# Altium project Tesis.PrjPcb
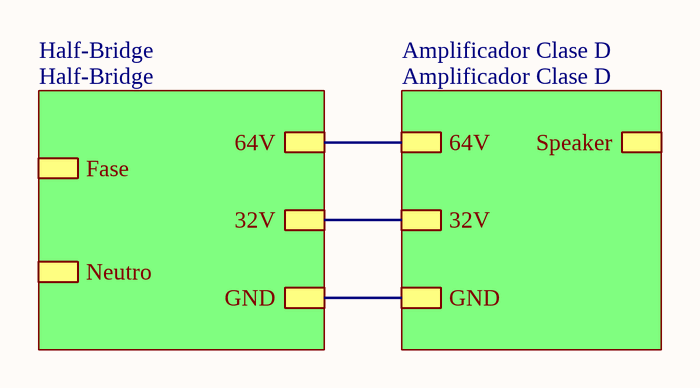
[diagram p0: Diagrama en bloques.SchDoc]
8 sheets, 136 parts. Net scope: hierarchical (ports join the sheet entries above them; power ports are global).
Board file: Filtros.PcbDoc
Sheets:
  Diagrama en bloques.SchDoc
    Half-Bridge = Half-Bridge.SchDoc
      Fly-Back = Fly-Back.SchDoc
  Step Down.SchDoc
  Pasa Altos.SchDoc
  Ganancia.SchDoc
  Generador De Retardo.SchDoc
  Mosfet Driver.SchDoc

## Sheet Diagrama en bloques.SchDoc
size A4; DocumentNumber: 1; SheetNumber: 1; SheetTotal: 5

### Sub-sheets
Amplificador Clase D = Amplificador Clase D (file not in this document): Speaker, 64V, 32V, GND
Half-Bridge = Half-Bridge: Fase, Neutro, 64V, 32V, GND

### Nets
NetC11_1: sheet Half-Bridge/64V, sheet Amplificador Clase D/64V
NetC11_2: sheet Half-Bridge/32V, sheet Amplificador Clase D/32V
NetC15_2: sheet Half-Bridge/GND, sheet Amplificador Clase D/GND

## Sheet Half-Bridge.SchDoc
size A4; DocumentNumber: 2; SheetNumber: 2; SheetTotal: 5
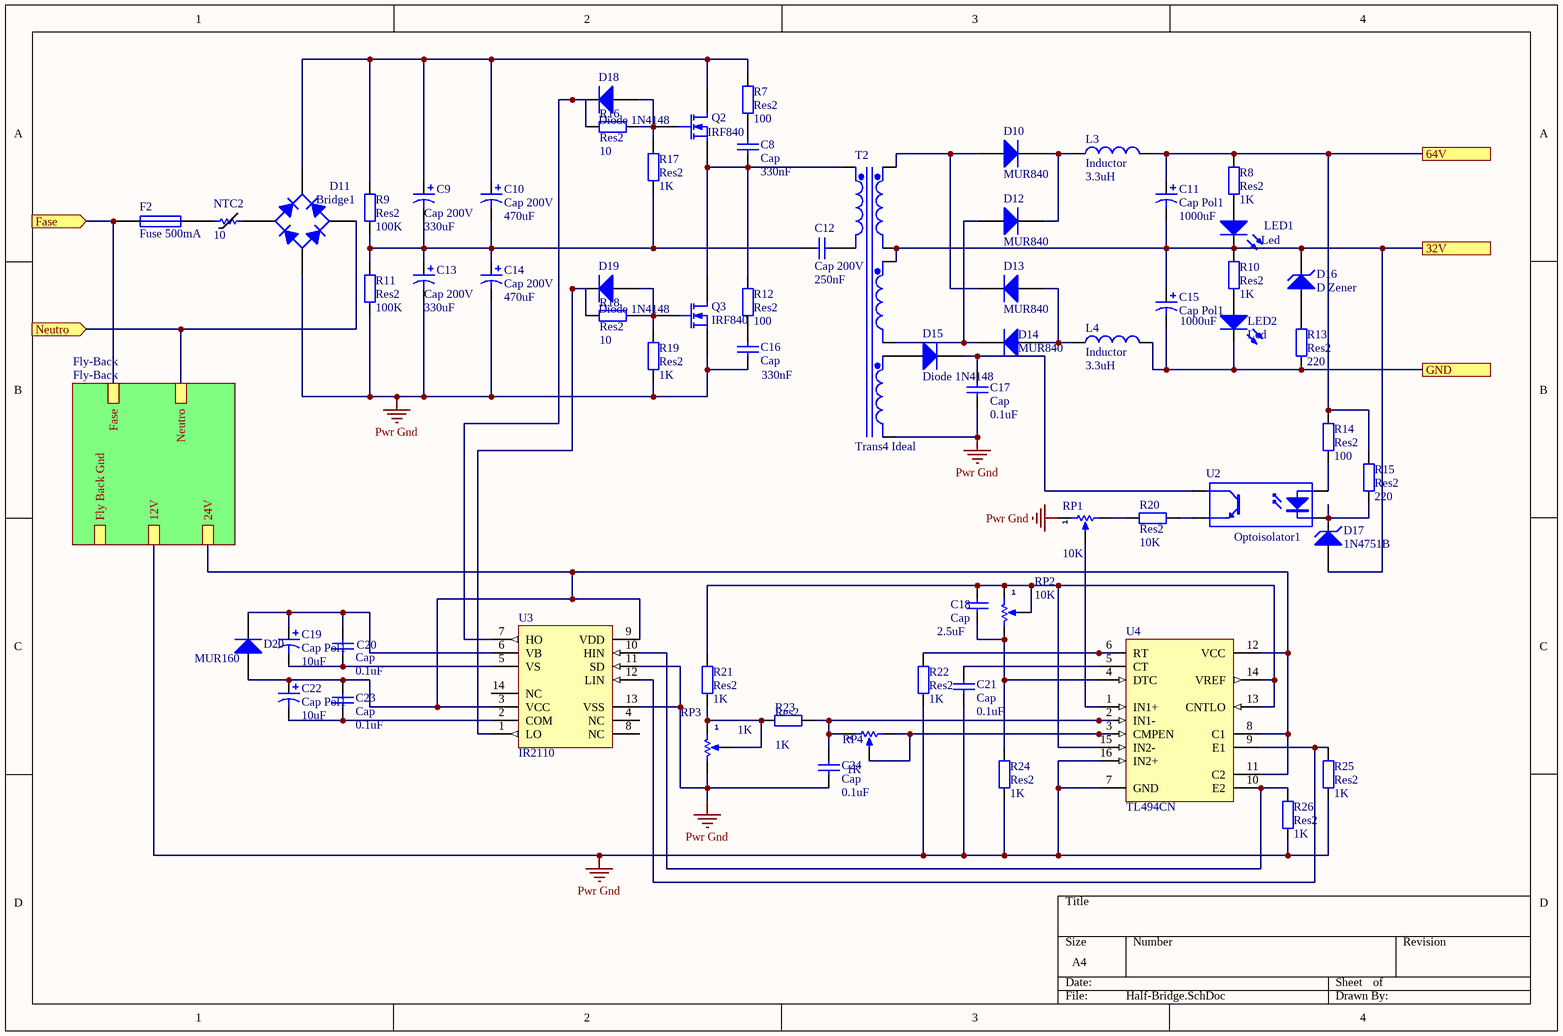
[diagram p1: Half-Bridge.SchDoc]

### Parts
C8  Cap  value 330nF  [RAD-0.3]
C9  Cap 200V  value 330uF  [RB7.6-15]
C10  Cap 200V  value 470uF  [RB7.6-15]
C11  Cap Pol1  value 1000uF  [RB7.6-15]
C12  Cap 200V  value 250nF  [RAD-0.3]
C13  Cap 200V  value 330uF  [RB7.6-15]
C14  Cap 200V  value 470uF  [RB7.6-15]
C15  Cap Pol1  value 1000uF  [RB7.6-15]
C16  Cap  value 330nF  [RAD-0.3]
C17  Cap  value 0.1uF  [RAD-0.3]
C18  Cap  value 2.5uF  [RAD-0.3]
C19  Cap Pol1  value 10uF  [RB7.6-15]
C20  Cap  value 0.1uF  [RAD-0.3]
C21  Cap  value 0.1uF  [RAD-0.3]
C22  Cap Pol1  value 10uF  [RB7.6-15]
C23  Cap  value 0.1uF  [RAD-0.3]
C24  Cap  value 0.1uF  [RAD-0.3]
D10  MUR840  [DO-35]
D11  Bridge1  [D-38]
D12  MUR840  [DO-35]
D13  MUR840  [DO-35]
D14  MUR840  [DO-35]
D15  Diode 1N4148  [DO-35]
D16  D Zener  [DIODE-0.7]
D17  1N4751B  [DIODE-0.7]
D18  Diode 1N4148  [DO-35]
D19  Diode 1N4148  [DO-35]
D20  MUR160  [DO-35]
F2  Fuse 500mA  [PIN-W2/E2.8]
L3  Inductor  value 3.3uH  [0402-A]
L4  Inductor  value 3.3uH  [0402-A]
LED1  VALOR: Led  [Led 3mm AMARILLO]  (hidden comment: Diodo Led)
LED2  VALOR: Led  [Led 3mm AMARILLO]  (hidden comment: Diodo Led)
NTC2  VALOR: 10  [R0805]  (hidden comment: Termistor NTC)
Q2  IRF840  [E3]
Q3  IRF840  [E3]
R7  Res2  value 100  [AXIAL-0.4]
R8  Res2  value 1K  [AXIAL-0.4]
R9  Res2  value 100K  [AXIAL-0.4]
R10  Res2  value 1K  [AXIAL-0.4]
R11  Res2  value 100K  [AXIAL-0.4]
R12  Res2  value 100  [AXIAL-0.4]
R13  Res2  value 220  [AXIAL-0.4]
R14  Res2  value 100  [AXIAL-0.4]
R15  Res2  value 220  [AXIAL-0.4]
R16  Res2  value 10  [AXIAL-0.4]
R17  Res2  value 1K  [AXIAL-0.4]
R18  Res2  value 10  [AXIAL-0.4]
R19  Res2  value 1K  [AXIAL-0.4]
R20  Res2  value 10K  [AXIAL-0.4]
R21  Res2  value 1K  [AXIAL-0.4]
R22  Res2  value 1K  [AXIAL-0.4]
R23  Res2  value 1K  [AXIAL-0.4]
R24  Res2  value 1K  [AXIAL-0.4]
R25  Res2  value 1K  [AXIAL-0.4]
R26  Res2  value 1K  [AXIAL-0.4]
RP1  VALOR: 10K  [Trimpot Multivuelta Horizontal]  (hidden comment: Trimpot)
RP2  VALOR: 10K  [Trimpot Multivuelta Horizontal]  (hidden comment: Trimpot)
RP3  VALOR: 1K  [Trimpot Multivuelta Horizontal]  (hidden comment: Trimpot)
RP4  VALOR: 1K  [Trimpot Multivuelta Horizontal]  (hidden comment: Trimpot)
T2  Trans4 Ideal  [TRF_8]
U2  Optoisolator1  [DIP-4]
U3  IR2110  [PDIP14]
U4  TL494CN  [DIP-16]

### Sub-sheets
Fly-Back = Fly-Back: 24V, 12V, Fly Back Gnd, Fase, Neutro

### Ports
32V, 64V, Fase (in), GND, Neutro (in)

### Nets
Pwr Gnd: C13.2 C14.2 C16.1 C17.1 C21.1 C24.1 D11.3(A) Q3.3(S) R11.1 R19.2 R22.1 R24.1 R25.1 R26.1 RP1.1(TOP) RP3.2(BOT) T2.8(Sec3-) U3.11(SD) U3.13(VSS) U4.7(GND) U4.16(IN2+) ; sheet Fly-Back/12V
NetC1_1: C22.1 C23.2 D20.1(A) U3.3(VCC) U3.9(VDD) U4.8(C1) U4.11(C2) U4.12(VCC) ; sheet Fly-Back/24V
NetC8_1: C8.1 Q2.3(S) Q3.1(D) R12.2 T2.1(Pri+)
NetC8_2: C8.2 R7.1
NetC9_1: C9.1 C10.1 D11.1(K) Q2.1(D) R7.2 R9.2
NetC9_2: C9.2 C10.2 C12.1 C13.1 C14.1 R9.1 R11.2 R17.1
NetC11_1: C11.1 L3.2 R8.2 R14.2 R15.2 ; port 64V
NetC11_2: C11.2 C15.1 D16.2(K) D17.1(A) LED1.2(K) R10.2 T2.4(Sec1-) T2.5(Sec2+) ; port 32V
NetC12_2: C12.2 T2.2(Pri-)
NetC15_2: C15.2 L4.2 LED2.2(K) R13.1 ; port GND
NetC16_2: C16.2 R12.1
NetC17_2: C17.2 D15.2(K) U2.4(C)
NetC18_1: C18.1 R24.2 RP2.2(BOT) U4.4(DTC)
NetC18_2: C18.2 R21.2 RP2.1(TOP) RP2.3(TAP) U4.13(CNTLO) U4.14(VREF) U4.15(IN2-)
NetC19_1: C19.1 C20.2 D20.2(K) U3.6(VB)
NetC19_2: C19.2 C20.1 U3.5(VS)
NetC21_2: C21.2 U4.5(CT)
NetC22_2: C22.2 C23.1 U3.2(COM)
NetC24_2: C24.2 R23.2 RP4.1(TOP) U4.2(IN1-)
NetD4_2: D11.2(C) ; port Neutro, sheet Fly-Back/Neutro
NetD10_1: D10.1(A) D13.2(K) T2.3(Sec1+)
NetD10_2: D10.2(K) D12.2(K) L3.1
NetD11_4: D11.4(C) NTC2.1
NetD12_1: D12.1(A) D14.2(K) T2.6(Sec2-)
NetD13_1: D13.1(A) D14.1(A) L4.1
NetD15_1: D15.1(A) T2.7(Sec3+)
NetD16_1: D16.1(A) R13.2
NetD17_2: D17.2(K) R15.1 U2.2(K)
NetD18_1: D18.1(A) Q2.2(G) R16.2 R17.2
NetD18_2: D18.2(K) R16.1 U3.7(HO)
NetD19_1: D19.1(A) Q3.2(G) R18.1 R19.1
NetD19_2: D19.2(K) R18.2 U3.1(LO)
NetF1_1: F2.1 ; port Fase, sheet Fly-Back/Fase
NetF2_2: F2.2 NTC2.2
NetLED1_1: LED1.1(A) R8.1
NetLED2_1: LED2.1(A) R10.1
NetR14_1: R14.1 U2.1(A)
NetR20_1: R20.1 U2.3(E)
NetR20_2: R20.2 RP1.2(BOT)
NetR21_1: R21.1 R23.1 RP3.1(TOP) RP3.3(TAP)
NetR22_2: R22.2 U4.6(RT)
NetR25_2: R25.2 U3.12(LIN) U4.9(E1)
NetR26_2: R26.2 U3.10(HIN) U4.10(E2)
NetRP1_3: RP1.3(TAP) U4.1(IN1+)
NetRP4_2: RP4.2(BOT) RP4.3(TAP) U4.3(CMPEN)

Not connected (* = marked no-connect by the designer): U3 4(NC) 8(NC) 14(NC)

### Library data of the parts
C8 C12 C16-C18 C20 C21 C23 C24 = Cap: Capacitor; Published: 8-Jun-2000; LatestRevisionDate: 17-Jul-2002; LatestRevisionNote: Re-released for DXP Platform.; PackageReference: RAD-0.3; Publisher: Altium Limited; PackageDescription: Radial Cap, Thru-Hole; 2 Leads; 0.3 in Pin Spacing
C9-C11 C13-C15 C19 C22 = Cap Pol1: Polarized Capacitor (Radial); Published: 8-Jun-2000; LatestRevisionDate: 17-Jul-2002; LatestRevisionNote: Re-released for DXP Platform.; PackageReference: RB7.6-15; Publisher: Altium Limited; PackageDescription: Polarized Capacitor (Radial); 2 Leads
D10 D12-D15 D18-D20 = Diode 1N4148: High Conductance Fast Diode; Published: 8-Jun-2000; LatestRevisionDate: 17-Jul-2002; LatestRevisionNote: Re-released for DXP Platform.; DatasheetVersion: 1997; PackageReference: DO-35; Publisher: Altium Limited; PackageDescription: Diode, Axial; Body 3.8 x 1.9 mm (LxDia. max), Lead Dia. 0.53 mm (max); Code_JEDEC: DO-204-AH; ComponentLink1Description: Manufacturer Link; ComponentLink1URL: http://www.fairchildsemi.com/; ComponentLink2Description: Datasheet; ComponentLink2URL: http://www.fairchildsemi.com/ds/1N%2F1N4148.pdf
D11 = Bridge1: Full Wave Diode Bridge; Published: 8-Jun-2000; LatestRevisionDate: 29-May-2009; LatestRevisionNote: Sch pins A & K swapped.; DatasheetVersion: E2732B; PackageReference: D-38; Publisher: Altium Limited; PackageDescription: Bridge Rectifier; 4 Terminals; Body 9.4 x 9.4 mm (typ); Pitch 5.08 mm
D16 D17 = D Zener: Zener Diode; Published: 8-Jun-2000; LatestRevisionDate: 17-Jul-2002; LatestRevisionNote: Re-released for DXP Platform.; PackageReference: DIODE-0.7; Publisher: Altium Limited; PackageDescription: Diode, Thru-Hole; 2 Leads; 0.7 in Pin Spacing
F2 = Fuse 1: Fuse; Published: 8-Jun-2000; LatestRevisionDate: 17-Jul-2002; LatestRevisionNote: Re-released for DXP Platform.; PackageReference: PIN-W2/E2.8; Publisher: Altium Limited; PackageDescription: Thru-Hole; 2 Leads
L3 L4 = Inductor: Code_IEC: 1005; Published: 8-Jun-2000; LatestRevisionDate: 29-May-2009; LatestRevisionNote: IPC-7351 Footprint Added.; PackageReference: 0402-A; Publisher: Altium Limited; PackageDescription: Chip Inductor; Code_JEITA: 0402
LED1 LED2 = Diodo Led: Led 3mm; CODIGO STI: *; PROVEEDOR: *; FABRICANTE: *
NTC2 = Termistor NTC: Termistor NTC SMD; PROVEEDOR: *; CODIGO STI: *; FABRICANTE: *
Q2 Q3 = MOSFET-N: N-Channel MOSFET; Published: 8-Jun-2000; LatestRevisionDate: 17-Jul-2002; LatestRevisionNote: Re-released for DXP Platform.; PackageVersion: 1995/1996; PackageReference: E3; Publisher: Altium Limited; PackageDescription: TO, Flat Index; 3 In-Line, Axial Leads; Body Dia. 4.6mm; Lead Dia. 0.5 mm (max)
R7-R26 = Res2: Resistor; Published: 8-Jun-2000; LatestRevisionDate: 17-Jul-2002; LatestRevisionNote: Re-released for DXP Platform.; PackageReference: AXIAL-0.4; Publisher: Altium Limited; PackageDescription: Axial Device, Thru-Hole; 2 Leads; 0.4 in Pin Spacing
RP1-RP4 = Trimpot: Preset; CODIGO STI: *; PROVEEDOR: *; FABRICANTE: *
  RP1: PART NUMBER: *
T2 = Trans4 Ideal: Four-winding Transformer (Ideal); Published: 25-Jan-2001; LatestRevisionDate: 17-Jul-2002; LatestRevisionNote: Re-released for DXP Platform.; PackageReference: TRF_8; Publisher: Altium Limited; PackageDescription: Transformer; 8 Leads
U2 = Optoisolator1: 4-Pin Phototransistor Optocoupler; Published: 24-Mar-1999; LatestRevisionDate: 04-Mar-2005; LatestRevisionNote: Sch pins 3 & 4 Swapped.; DatasheetVersion: Nov-2003; PackageReference: DIP-4; Publisher: Altium Limited
U3 = IR2110: High and Low Side Driver; Note: Pins 4, 8 and 14 are not connected; Published: 8-Jun-2000; LatestRevisionDate: 04-Mar-2005; LatestRevisionNote: Stylized 3D Model Added.; DatasheetVersion: PD60147J; PackageReference: PDIP14; Publisher: Altium Limited; PackageDescription: DIP; 14 Leads; Row Spacing 7.62 mm; Pitch 2.54 mm; ComponentLink1Description: Manufacturer Link; ComponentLink1URL: http://www.irf.com/; ComponentLink2Description: Datasheet; ComponentLink2URL: http://www.irf.com/product-info/datasheets/data/ir2110.pdf
U4 = TL494CN: Switchmode Pulse Width Modulation Control Circuit; Published: 15-Apr-2002; DatasheetVersion: 1996; PackageVersion: Apr-2000; PackageReference: 648-08; Publisher: Altium Limited; PackageDescription: DIP; 16 Leads; Row Spacing 7.62 mm; Pitch 2.54 mm; Code_JEDEC: MS-001-BB; ComponentLink1Description: Manufacturer Link; ComponentLink1URL: http://www.onsemi.com/site/products/taxonomy/0,4438,503,00.html; ComponentLink2Description: Datasheet; ComponentLink2URL: http://www.onsemi.com/pub/Collateral/TL494-D.PDF

## Sheet Fly-Back.SchDoc
size A4; DocumentNumber: 3; SheetNumber: 3; SheetTotal: 5
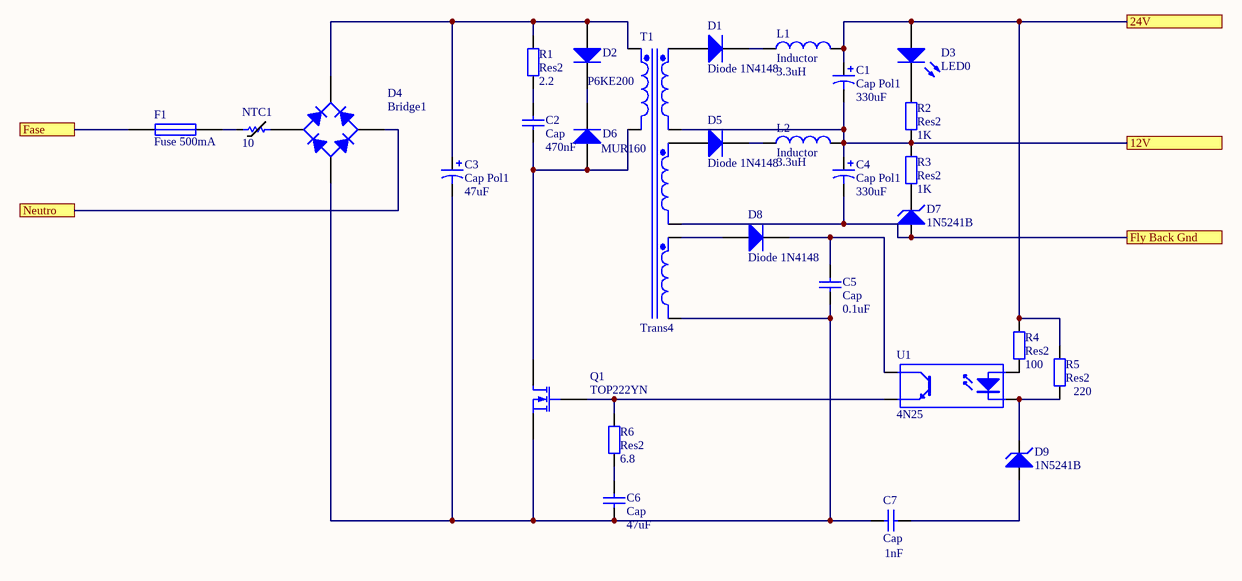
[diagram p2: Fly-Back.SchDoc]

### Parts
C1  Cap Pol1  value 330uF  [RB7.6-15]
C2  Cap  value 470nF  [RAD-0.3]
C3  Cap Pol1  value 47uF  [RB7.6-15]
C4  Cap Pol1  value 330uF  [RB7.6-15]
C5  Cap  value 0.1uF  [RAD-0.3]
C6  Cap  value 47uF  [RAD-0.3]
C7  Cap  value 1nF  [RAD-0.3]
D1  Diode 1N4148  [DO-35]
D2  P6KE200  [DO-35]
D3  LED0  [LED-0]
D4  Bridge1  [D-38]
D5  Diode 1N4148  [DO-35]
D6  MUR160  [DO-35]
D7  VALOR: 1N5241B  [DO-41]  (hidden comment: Diodo Zener)
D8  Diode 1N4148  [DO-35]
D9  VALOR: 1N5241B  [DO-41]  (hidden comment: Diodo Zener)
F1  Fuse 500mA  [PIN-W2/E2.8]
L1  Inductor  value 3.3uH  [0402-A]
L2  Inductor  value 3.3uH  [0402-A]
NTC1  VALOR: 10  [R0805]  (hidden comment: Termistor NTC)
Q1  TOP222YN  [E3]
R1  Res2  value 2.2  [AXIAL-0.4]
R2  Res2  value 1K  [AXIAL-0.4]
R3  Res2  value 1K  [AXIAL-0.4]
R4  Res2  value 100  [AXIAL-0.4]
R5  Res2  value 220  [AXIAL-0.4]
R6  Res2  value 6.8  [AXIAL-0.4]
T1  Trans4  [TRF_8]
U1  4N25  [DIP-4]

### Ports
12V, 24V, Fase, Fly Back Gnd, Neutro

### Nets
Pwr Gnd: C1.2 C4.1 L2.2 R2.1 R3.2 T1.4(Sec1-) ; port 12V
NetC1_1: C1.1 D3.1(A) L1.2 R4.2 R5.2 ; port 24V
NetC2_1: C2.1 D6.1(A) Q1.1(D) T1.2(Pri-)
NetC2_2: C2.2 R1.1
NetC3_1: C3.1 D2.1(A) D4.1(K) R1.2 T1.1(Pri+)
NetC3_2: C3.2 C5.1 C6.1 C7.1 D4.3(A) Q1.3(S) T1.8(Sec3-)
NetC4_2: C4.2 D7.1(A) T1.6(Sec2-) ; port Fly Back Gnd
NetC5_2: C5.2 D8.2(K) U1.4(C)
NetC6_2: C6.2 R6.1
NetC7_2: C7.2 D9.1(A)
NetD1_1: D1.1(A) T1.3(Sec1+)
NetD1_2: D1.2(K) L1.1
NetD2_2: D2.2(K) D6.2(K)
NetD3_2: D3.2(K) R2.2
NetD4_2: D4.2(C) ; port Neutro
NetD4_4: D4.4(C) NTC1.1
NetD5_1: D5.1(A) T1.5(Sec2+)
NetD5_2: D5.2(K) L2.1
NetD7_2: D7.2(K) R3.1
NetD8_1: D8.1(A) T1.7(Sec3+)
NetD9_2: D9.2(K) R5.1 U1.2(K)
NetF1_1: F1.1 ; port Fase
NetF1_2: F1.2 NTC1.2
NetQ1_2: Q1.2(G) R6.2 U1.3(E)
NetR4_1: R4.1 U1.1(A)

### Library data of the parts
C1 C3 C4 = Cap Pol1: Polarized Capacitor (Radial); Published: 8-Jun-2000; LatestRevisionDate: 17-Jul-2002; LatestRevisionNote: Re-released for DXP Platform.; PackageReference: RB7.6-15; Publisher: Altium Limited; PackageDescription: Polarized Capacitor (Radial); 2 Leads
C2 C5-C7 = Cap: Capacitor; Published: 8-Jun-2000; LatestRevisionDate: 17-Jul-2002; LatestRevisionNote: Re-released for DXP Platform.; PackageReference: RAD-0.3; Publisher: Altium Limited; PackageDescription: Radial Cap, Thru-Hole; 2 Leads; 0.3 in Pin Spacing
D1 D2 D5 D6 D8 = Diode 1N4148: High Conductance Fast Diode; Published: 8-Jun-2000; LatestRevisionDate: 17-Jul-2002; LatestRevisionNote: Re-released for DXP Platform.; DatasheetVersion: 1997; PackageReference: DO-35; Publisher: Altium Limited; PackageDescription: Diode, Axial; Body 3.8 x 1.9 mm (LxDia. max), Lead Dia. 0.53 mm (max); Code_JEDEC: DO-204-AH; ComponentLink1Description: Manufacturer Link; ComponentLink1URL: http://www.fairchildsemi.com/; ComponentLink2Description: Datasheet; ComponentLink2URL: http://www.fairchildsemi.com/ds/1N%2F1N4148.pdf
D3 = LED0: Typical INFRARED GaAs LED; Published: 8-Jun-2000; LatestRevisionDate: 08-Jul-2005; LatestRevisionNote: Mech Layer 1 removed.; PackageReference: LED-0; Publisher: Altium Limited; PackageDescription: LED; 2 Leads
D4 = Bridge1: Full Wave Diode Bridge; Published: 8-Jun-2000; LatestRevisionDate: 29-May-2009; LatestRevisionNote: Sch pins A & K swapped.; DatasheetVersion: E2732B; PackageReference: D-38; Publisher: Altium Limited; PackageDescription: Bridge Rectifier; 4 Terminals; Body 9.4 x 9.4 mm (typ); Pitch 5.08 mm
F1 = Fuse 1: Fuse; Published: 8-Jun-2000; LatestRevisionDate: 17-Jul-2002; LatestRevisionNote: Re-released for DXP Platform.; PackageReference: PIN-W2/E2.8; Publisher: Altium Limited; PackageDescription: Thru-Hole; 2 Leads
L1 L2 = Inductor: Code_IEC: 1005; Published: 8-Jun-2000; LatestRevisionDate: 29-May-2009; LatestRevisionNote: IPC-7351 Footprint Added.; PackageReference: 0402-A; Publisher: Altium Limited; PackageDescription: Chip Inductor; Code_JEITA: 0402
NTC1 = Termistor NTC: Termistor NTC SMD; PROVEEDOR: *; CODIGO STI: *; FABRICANTE: *
Q1 = MOSFET-N: N-Channel MOSFET; Published: 8-Jun-2000; LatestRevisionDate: 17-Jul-2002; LatestRevisionNote: Re-released for DXP Platform.; PackageVersion: 1995/1996; PackageReference: E3; Publisher: Altium Limited; PackageDescription: TO, Flat Index; 3 In-Line, Axial Leads; Body Dia. 4.6mm; Lead Dia. 0.5 mm (max)
R1-R6 = Res2: Resistor; Published: 8-Jun-2000; LatestRevisionDate: 17-Jul-2002; LatestRevisionNote: Re-released for DXP Platform.; PackageReference: AXIAL-0.4; Publisher: Altium Limited; PackageDescription: Axial Device, Thru-Hole; 2 Leads; 0.4 in Pin Spacing
T1 = Trans4: Four-winding Transformer (Non-Ideal); Sim Note: Enter the turns ratios, Core loss resistance, Magnetising Reactance, Leakage Reactances and Resistances referred to the primary side into the parameter fields.; Published: 25-Jan-2001; LatestRevisionDate: 17-Jul-2002; LatestRevisionNote: Re-released for DXP Platform.; PackageReference: TRF_8; Publisher: Altium Limited; PackageDescription: Transformer; 8 Leads
U1 = Optoisolator1: 4-Pin Phototransistor Optocoupler; Published: 24-Mar-1999; LatestRevisionDate: 04-Mar-2005; LatestRevisionNote: Sch pins 3 & 4 Swapped.; DatasheetVersion: Nov-2003; PackageReference: DIP-4; Publisher: Altium Limited
D7 D9 = Diodo Zener: CODIGO STI: *; PROVEEDOR: *; FABRICANTE: *

## Sheet Step Down.SchDoc
size A4
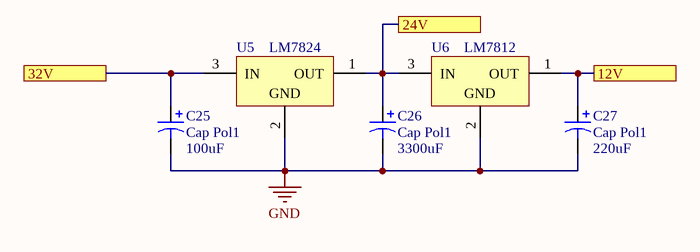
[diagram p3: Step Down.SchDoc]

### Parts
C25  Cap Pol1  value 100uF  [RB7.6-15]
C26  Cap Pol1  value 3300uF  [RB7.6-15]
C27  Cap Pol1  value 220uF  [RB7.6-15]
U5  LM7824  [Z03A]
U6  LM7812  [Z03A]

### Ports
12V, 24V, 32V

### Nets
GND: C25.2 C26.2 C27.2 U5.2(GND) U6.2(GND)
NetC25_1: C25.1 U5.3(IN) ; port 32V
NetC26_1: C26.1 U5.1(OUT) U6.3(IN) ; port 24V
NetC27_1: C27.1 U6.1(OUT) ; port 12V

### Library data of the parts
C25-C27 = Cap Pol1: Polarized Capacitor (Radial); Published: 8-Jun-2000; LatestRevisionDate: 17-Jul-2002; LatestRevisionNote: Re-released for DXP Platform.; PackageReference: RB7.6-15; Publisher: Altium Limited; PackageDescription: Polarized Capacitor (Radial); 2 Leads
U5 U6 = LM78L12ACZ: 3-Terminal Positive Regulators, 3-pin TO-92; Manufacturer: National Semiconductor; PackageTopMarking: NSXYTT*LM78L*12ACZ; PowerWise: N; CompType: LDO IC; Published: 4-Dec-2008; DatasheetVersion: Apr-2006; PackageVersion: revG, Sep-2000; PackageReference: Z03A; Publisher: Altium Limited; PackageDescription: TO-92, Molded, 3 Lead; Supplier 1: Farnell; Supplier Part Number 1: 9490272; PartNumber: LM78L12ACZ; RoHS: N; PinCount: 3; Code_JEDEC: TO-226-AA; ComponentLink1Description: LM78L12 Datasheet; ComponentLink1URL: http://www.national.com/ds/LM/LM78L12.pdf; ComponentLink2Description: LM78L12 Web Page; ComponentLink2URL: http://www.national.com/pf/LM/LM78L12.html; ComponentLink3Description: Z03A Package Page; ComponentLink3URL: http://www.national.com/packaging/folders/z03a.html

## Sheet Pasa Altos.SchDoc
size A4
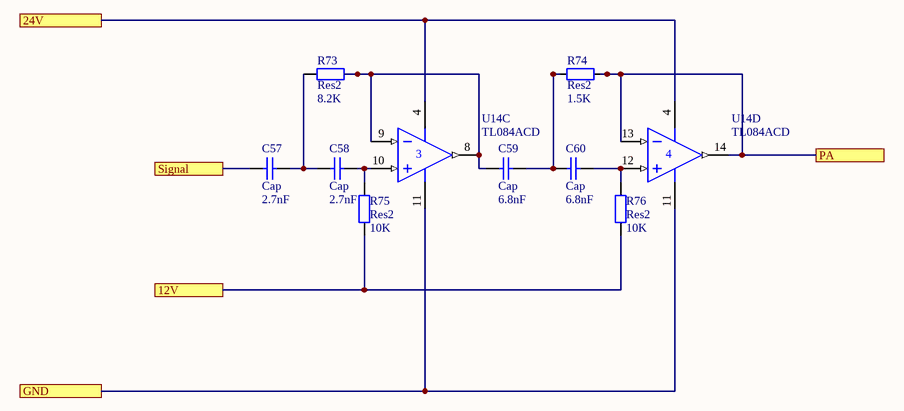
[diagram p4: Pasa Altos.SchDoc]

### Parts
C57  Cap  value 2.7nF  [rad-0.2]
C58  Cap  value 2.7nF  [rad-0.2]
C59  Cap  value 6.8nF  [rad-0.2]
C60  Cap  value 6.8nF  [rad-0.2]
R73  Res2  value 8.2K  [1206 resistor]
R74  Res2  value 1.5K  [1206 resistor]
R75  Res2  value 10K  [1206 resistor]
R76  Res2  value 10K  [1206 resistor]
U14  TL084ACD  [751A-02_N]  (parts C,D of 4)

### Ports
12V, 24V, GND, PA, Signal

### Nets
NetC57_1: C57.1 C58.2 R73.1
NetC57_2: C57.2 ; port Signal
NetC58_1: C58.1 R75.2 U14.10(IN+)
NetC59_1: C59.1 C60.2 R74.1
NetC59_2: C59.2 R73.2 U14.8(OUT) U14.9(IN-)
NetC60_1: C60.1 R76.2 U14.12(IN+)
NetR74_2: R74.2 U14.13(IN-) U14.14(OUT) ; port PA
NetR75_1: R75.1 R76.1 ; port 12V
NetU14_4: U14.4(V+) ; port 24V
NetU14_11: U14.11(V-) ; port GND

### Library data of the parts
C57-C60 = Cap: Capacitor; Published: 8-Jun-2000; LatestRevisionDate: 17-Jul-2002; LatestRevisionNote: Re-released for DXP Platform.; PackageReference: RAD-0.3; Publisher: Altium Limited; PackageDescription: Radial Cap, Thru-Hole; 2 Leads; 0.3 in Pin Spacing
R73-R76 = Res2: Resistor; Published: 8-Jun-2000; LatestRevisionDate: 17-Jul-2002; LatestRevisionNote: Re-released for DXP Platform.; PackageReference: AXIAL-0.4; Publisher: Altium Limited; PackageDescription: Axial Device, Thru-Hole; 2 Leads; 0.4 in Pin Spacing
U14 = TL084ACD: JFET-Input Operational Amplifier; Published: 17-Jul-2002; LatestRevisionDate: 13-Apr-2006; LatestRevisionNote: IPC-7351 Footprint Added.; DatasheetVersion: 1988; PackageVersion: 1991; PackageReference: 751A-02; Publisher: Altium Limited; PackageDescription: 14-Pin Small Outline Integrated Circuit 1.27 mm Pitch; Code_IPC: SOIC127P600-14; ComponentLink1Description: Manufacturer Link; ComponentLink1URL: http://www.onsemi.com/site/products/parametrics/0,4446,251,00.html

## Sheet Ganancia.SchDoc
size A4
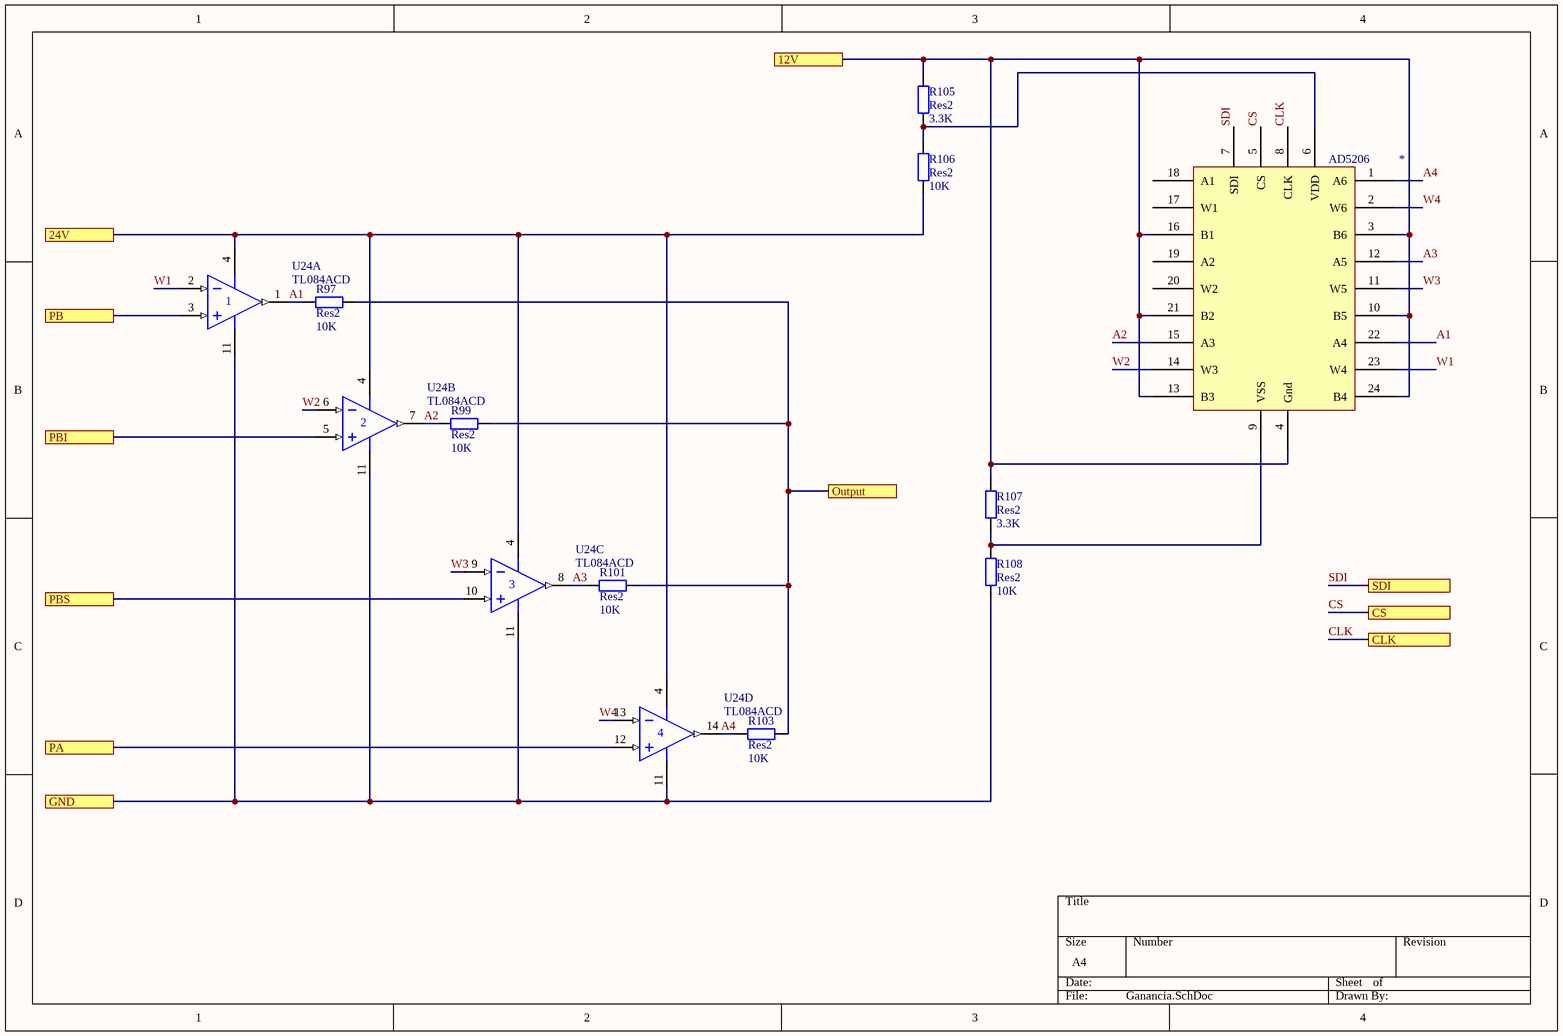
[diagram p5: Ganancia.SchDoc]

### Parts
*  AD5206  [DIP-24/D31]
R97  Res2  value 10K  [1206 resistor]
R99  Res2  value 10K  [1206 resistor]
R101  Res2  value 10K  [1206 resistor]
R103  Res2  value 10K  [1206 resistor]
R105  Res2  value 3.3K  [1206 resistor]
R106  Res2  value 10K  [1206 resistor]
R107  Res2  value 3.3K  [1206 resistor]
R108  Res2  value 10K  [1206 resistor]
U24  TL084ACD  [751A-02_N]  (parts A,B,C,D of 4)

### Ports
12V, 24V, CLK, CS, GND, Output, PA, PB, PBI, PBS, SDI

### Nets
A1: *.22(A4) R97.1 U24.1(OUT)
A2: *.15(A3) R99.1 U24.7(OUT)
A3: *.12(A5) R101.1 U24.8(OUT)
A4: *.1(A6) R103.1 U24.14(OUT)
CLK: *.8(CLK) ; port CLK
CS: *.5(CS) ; port CS
SDI: *.7(SDI) ; port SDI
W1: *.23(W4) U24.2(IN-)
W2: *.14(W3) U24.6(IN-)
W3: *.11(W5) U24.9(IN-)
W4: *.2(W6) U24.13(IN-)
Net*_3: *.3(B6) *.4(Gnd) *.10(B5) *.13(B3) *.16(B1) *.21(B2) *.24(B4) R105.2 R107.2 ; port 12V
Net*_6: *.6(VDD) R105.1 R106.2
Net*_9: *.9(VSS) R107.1 R108.2
NetR97_2: R97.2 R99.2 R101.2 R103.2 ; port Output
NetR106_1: R106.1 U24.4(V+) ; port 24V
NetR108_1: R108.1 U24.11(V-) ; port GND
NetU24_3: U24.3(IN+) ; port PB
NetU24_5: U24.5(IN+) ; port PBI
NetU24_10: U24.10(IN+) ; port PBS
NetU24_12: U24.12(IN+) ; port PA

Not connected (* = marked no-connect by the designer): * 17(W1) 18(A1) 19(A2) 20(W2)

### Library data of the parts
R97 R99 R101 R103 R105-R108 = Res2: Resistor; Published: 8-Jun-2000; LatestRevisionDate: 17-Jul-2002; LatestRevisionNote: Re-released for DXP Platform.; PackageReference: AXIAL-0.4; Publisher: Altium Limited; PackageDescription: Axial Device, Thru-Hole; 2 Leads; 0.4 in Pin Spacing
U24 = TL084ACD: JFET-Input Operational Amplifier; Published: 17-Jul-2002; LatestRevisionDate: 13-Apr-2006; LatestRevisionNote: IPC-7351 Footprint Added.; DatasheetVersion: 1988; PackageVersion: 1991; PackageReference: 751A-02; Publisher: Altium Limited; PackageDescription: 14-Pin Small Outline Integrated Circuit 1.27 mm Pitch; Code_IPC: SOIC127P600-14; ComponentLink1Description: Manufacturer Link; ComponentLink1URL: http://www.onsemi.com/site/products/parametrics/0,4446,251,00.html

## Sheet Generador De Retardo.SchDoc
size A4
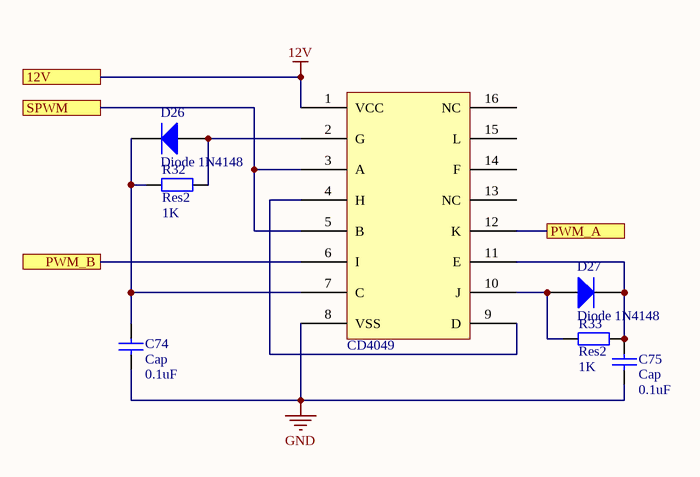
[diagram p6: Generador De Retardo.SchDoc]

### Parts
?  CD4049  [PDIP16]
C74  Cap  value 0.1uF  [RAD-0.3]
C75  Cap  value 0.1uF  [RAD-0.3]
D26  Diode 1N4148  [DO-35]
D27  Diode 1N4148  [DO-35]
R32  Res2  value 1K  [AXIAL-0.4]
R33  Res2  value 1K  [AXIAL-0.4]

### Ports
12V, PWM_A, PWM_B, SPWM

### Nets
12V: ?.1(VCC) ; port 12V
GND: ?.8(VSS) C74.1 C75.1
Net?_2: ?.2(G) D26.1(A) R32.2
Net?_3: ?.3(A) ?.5(B) ; port SPWM
Net?_4: ?.4(H) ?.9(D)
Net?_6: ?.6(I) ; port PWM_B
Net?_7: ?.7(C) C74.2 D26.2(K) R32.1
Net?_10: ?.10(J) D27.1(A) R33.1
Net?_11: ?.11(E) C75.2 D27.2(K) R33.2
Net?_12: ?.12(K) ; port PWM_A

Not connected (* = marked no-connect by the designer): ? 13(NC) 14(F) 15(L) 16(NC)

### Library data of the parts
C74 C75 = Cap: Capacitor; Published: 8-Jun-2000; LatestRevisionDate: 17-Jul-2002; LatestRevisionNote: Re-released for DXP Platform.; PackageReference: RAD-0.3; Publisher: Altium Limited; PackageDescription: Radial Cap, Thru-Hole; 2 Leads; 0.3 in Pin Spacing
D26 D27 = Diode 1N4148: High Conductance Fast Diode; Published: 8-Jun-2000; LatestRevisionDate: 17-Jul-2002; LatestRevisionNote: Re-released for DXP Platform.; DatasheetVersion: 1997; PackageReference: DO-35; Publisher: Altium Limited; PackageDescription: Diode, Axial; Body 3.8 x 1.9 mm (LxDia. max), Lead Dia. 0.53 mm (max); Code_JEDEC: DO-204-AH; ComponentLink1Description: Manufacturer Link; ComponentLink1URL: http://www.fairchildsemi.com/; ComponentLink2Description: Datasheet; ComponentLink2URL: http://www.fairchildsemi.com/ds/1N%2F1N4148.pdf
R32 R33 = Res2: Resistor; Published: 8-Jun-2000; LatestRevisionDate: 17-Jul-2002; LatestRevisionNote: Re-released for DXP Platform.; PackageReference: AXIAL-0.4; Publisher: Altium Limited; PackageDescription: Axial Device, Thru-Hole; 2 Leads; 0.4 in Pin Spacing

## Sheet Mosfet Driver.SchDoc
size A4
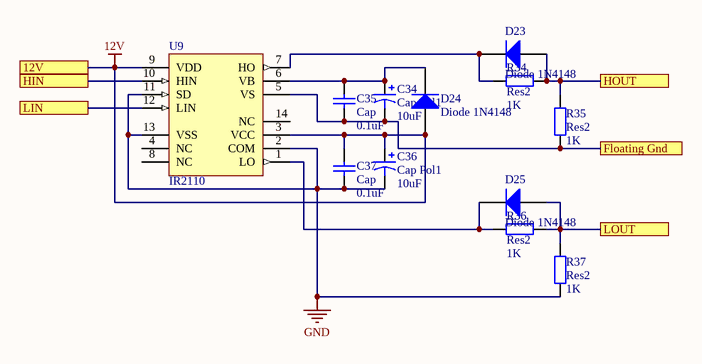
[diagram p7: Mosfet Driver.SchDoc]

### Parts
C34  Cap Pol1  value 10uF  [RB7.6-15]
C35  Cap  value 0.1uF  [RAD-0.3]
C36  Cap Pol1  value 10uF  [RB7.6-15]
C37  Cap  value 0.1uF  [RAD-0.3]
D23  Diode 1N4148  [DO-35]
D24  Diode 1N4148  [DO-35]
D25  Diode 1N4148  [DO-35]
R34  Res2  value 1K  [AXIAL-0.4]
R35  Res2  value 1K  [AXIAL-0.4]
R36  Res2  value 1K  [AXIAL-0.4]
R37  Res2  value 1K  [AXIAL-0.4]
U9  IR2110  [PDIP14]

### Ports
12V, Floating Gnd, HIN, HOUT, LIN, LOUT

### Nets
12V: C36.1 C37.2 D24.1(A) U9.3(VCC) U9.9(VDD) ; port 12V
GND: C36.2 C37.1 R37.2 U9.2(COM) U9.11(SD) U9.13(VSS)
NetC34_1: C34.1 C35.2 D24.2(K) U9.6(VB)
NetC34_2: C34.2 C35.1 R35.1 U9.5(VS) ; port Floating Gnd
NetD23_1: D23.1(A) R34.2 R35.2 ; port HOUT
NetD23_2: D23.2(K) R34.1 U9.7(HO)
NetD25_1: D25.1(A) R36.1 R37.1 ; port LOUT
NetD25_2: D25.2(K) R36.2 U9.1(LO)
NetU9_10: U9.10(HIN) ; port HIN
NetU9_12: U9.12(LIN) ; port LIN

Not connected (* = marked no-connect by the designer): U9 4(NC) 8(NC) 14(NC)

### Library data of the parts
C34 C36 = Cap Pol1: Polarized Capacitor (Radial); Published: 8-Jun-2000; LatestRevisionDate: 17-Jul-2002; LatestRevisionNote: Re-released for DXP Platform.; PackageReference: RB7.6-15; Publisher: Altium Limited; PackageDescription: Polarized Capacitor (Radial); 2 Leads
C35 C37 = Cap: Capacitor; Published: 8-Jun-2000; LatestRevisionDate: 17-Jul-2002; LatestRevisionNote: Re-released for DXP Platform.; PackageReference: RAD-0.3; Publisher: Altium Limited; PackageDescription: Radial Cap, Thru-Hole; 2 Leads; 0.3 in Pin Spacing
D23-D25 = Diode 1N4148: High Conductance Fast Diode; Published: 8-Jun-2000; LatestRevisionDate: 17-Jul-2002; LatestRevisionNote: Re-released for DXP Platform.; DatasheetVersion: 1997; PackageReference: DO-35; Publisher: Altium Limited; PackageDescription: Diode, Axial; Body 3.8 x 1.9 mm (LxDia. max), Lead Dia. 0.53 mm (max); Code_JEDEC: DO-204-AH; ComponentLink1Description: Manufacturer Link; ComponentLink1URL: http://www.fairchildsemi.com/; ComponentLink2Description: Datasheet; ComponentLink2URL: http://www.fairchildsemi.com/ds/1N%2F1N4148.pdf
R34-R37 = Res2: Resistor; Published: 8-Jun-2000; LatestRevisionDate: 17-Jul-2002; LatestRevisionNote: Re-released for DXP Platform.; PackageReference: AXIAL-0.4; Publisher: Altium Limited; PackageDescription: Axial Device, Thru-Hole; 2 Leads; 0.4 in Pin Spacing
U9 = IR2110: as U3 on sheet Half-Bridge; Published: 8-Jun-2000; LatestRevisionDate: 04-Mar-2005; LatestRevisionNote: Stylized 3D Model Added.; DatasheetVersion: PD60147J; PackageReference: PDIP14; Publisher: Altium Limited; PackageDescription: DIP; 14 Leads; Row Spacing 7.62 mm; Pitch 2.54 mm; ComponentLink1Description: Manufacturer Link; ComponentLink1URL: http://www.irf.com/; ComponentLink2Description: Datasheet; ComponentLink2URL: http://www.irf.com/product-info/datasheets/data/ir2110.pdf

## Nets that join several sheets
12V: Generador De Retardo (?.1), Mosfet Driver (5 pins)
GND: Step Down (5 pins), Generador De Retardo (?.8 C74.1 C75.1), Mosfet Driver (6 pins)
Pwr Gnd: Half-Bridge (21 pins), Fly-Back (6 pins)
NetC1_1: Half-Bridge (8 pins), Fly-Back (5 pins)
NetD4_2: Half-Bridge (D11.2), Fly-Back (D4.2)
NetF1_1: Half-Bridge (F2.1), Fly-Back (F1.1)